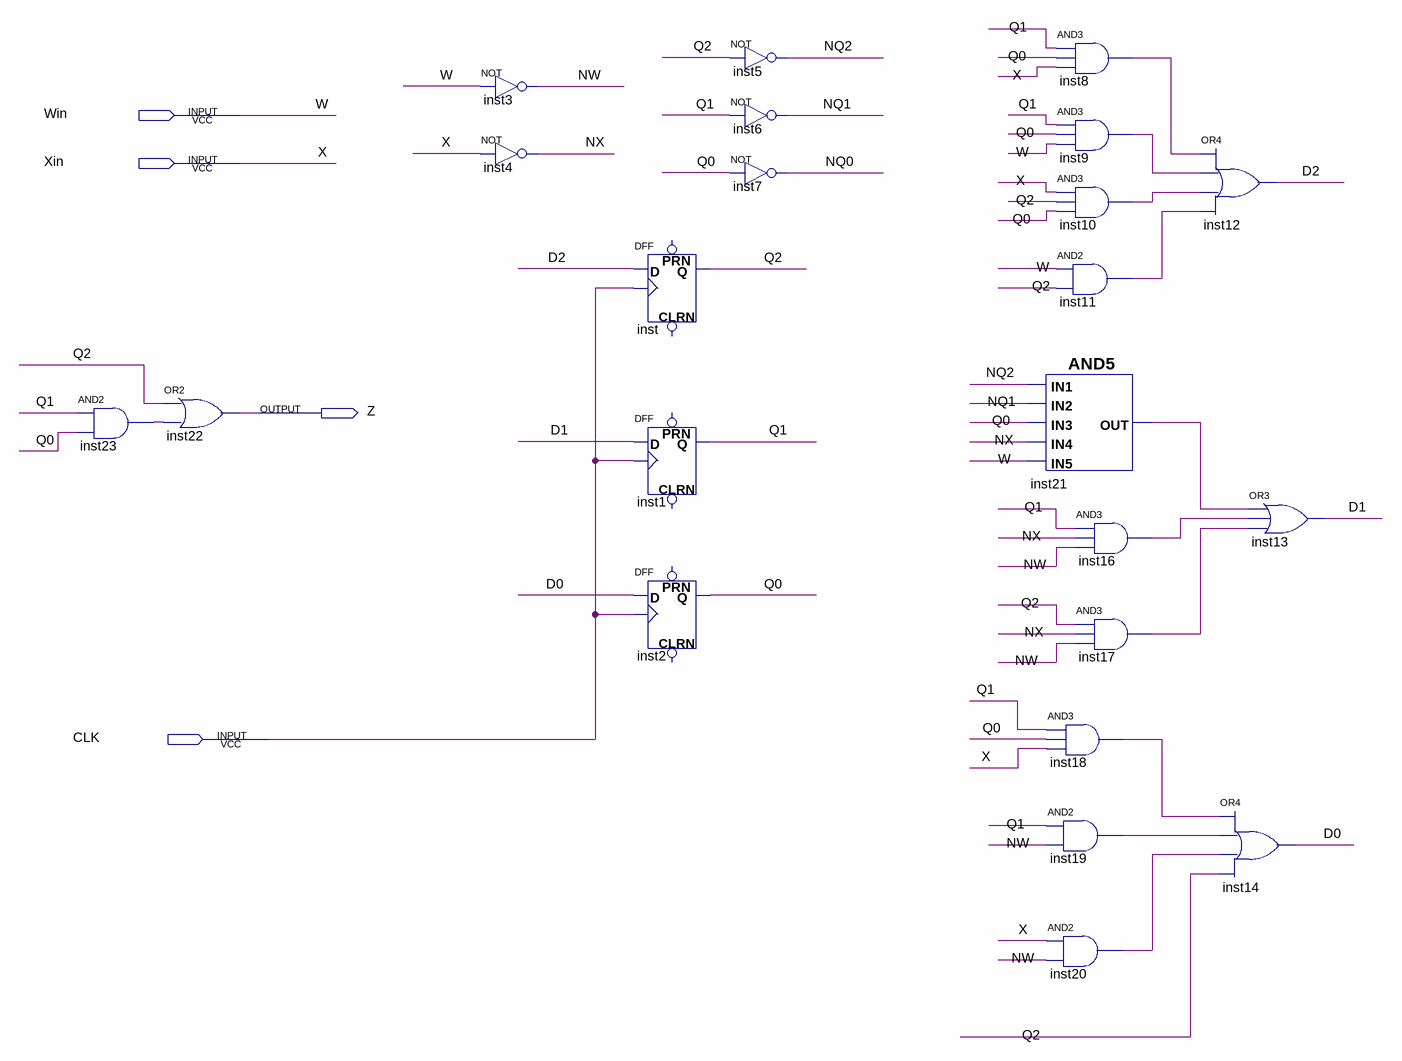
[diagram p0: schematic sheet]
// Quartus schematic moore.bdf as structural Verilog: 23 symbols, 4 pins
module moore (
  input  Win,
  input  Xin,
  input  CLK,
  output Z
);

  wire D0, D1, D2, inst8_out, inst9_out, inst10_out, inst11_out, inst16_out, inst17_out, inst18_out,
       inst19_out, inst20_out, inst21_out, inst23_out, NQ0, NQ1, NQ2, NW, NX, Q0, Q1, Q2;

  and inst23 (inst23_out, Q1, Q0);
  or inst22 (Z, Q2, inst23_out);
  not inst3 (NW, Win);
  not inst4 (NX, Xin);
  DFF inst (.CLK(CLK), .D(D2), .Q(Q2));  // open: CLRN, PRN
  DFF inst1 (.CLK(CLK), .D(D1), .Q(Q1));  // open: CLRN, PRN
  DFF inst2 (.CLK(CLK), .D(D0), .Q(Q0));  // open: CLRN, PRN
  not inst5 (NQ2, Q2);
  not inst6 (NQ1, Q1);
  not inst7 (NQ0, Q0);
  and inst21 (inst21_out, NQ2, NQ1, Q0, NX, Win);
  and inst8 (inst8_out, Q1, Q0, Xin);
  and inst9 (inst9_out, Q1, Q0, Win);
  and inst10 (inst10_out, Xin, Q2, Q0);
  and inst11 (inst11_out, Win, Q2);
  and inst16 (inst16_out, Q1, NX, NW);
  and inst17 (inst17_out, Q2, NX, NW);
  and inst18 (inst18_out, Q1, Q0, Xin);
  and inst19 (inst19_out, Q1, NW);
  and inst20 (inst20_out, Xin, NW);
  or inst12 (D2, inst8_out, inst9_out, inst10_out, inst11_out);
  or inst13 (D1, inst21_out, inst16_out, inst17_out);
  or inst14 (D0, inst18_out, inst19_out, inst20_out, Q2);

  // Other names for the same wires on the sheet: W = Win; X = Xin
endmodule
